# EAGLE design contact control board (EAGLE 6.5.0)
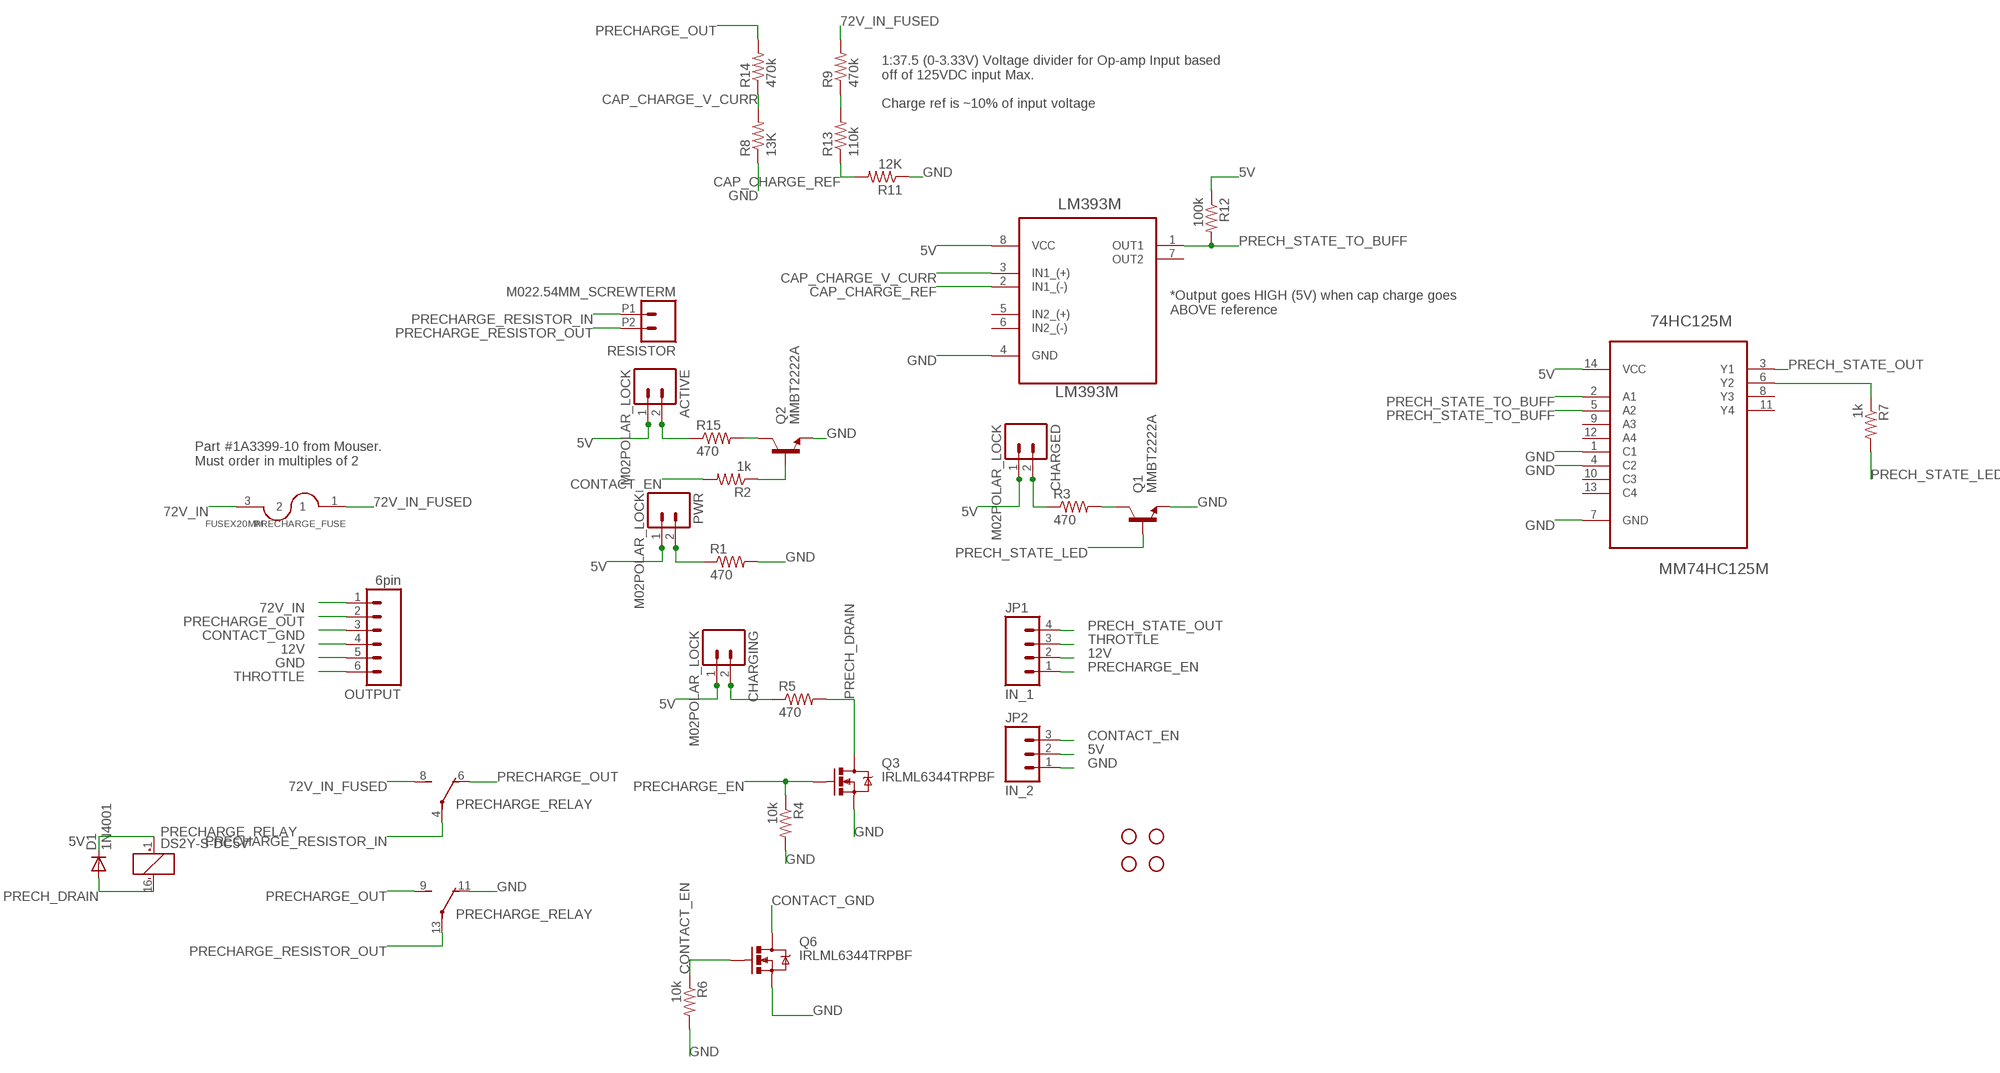
[diagram p0: schematic, sheet 1]

## Parts
74HC125M  MM74HC125M  [SOIC127P600X175-14N]
ACTIVE  M02POLAR_LOCK  [MOLEX-1X2_LOCK]
CHARGED  M02POLAR_LOCK  [MOLEX-1X2_LOCK]
CHARGING  M02POLAR_LOCK  [MOLEX-1X2_LOCK]
D1  1N4001  DIODEPTH  [DIODE-1N4001]
JP1  IN_1  M04POLAR_LOCK  [MOLEX-1X4_LOCK]
JP2  IN_2  M03POLAR_LOCK  [MOLEX-1X3_LOCK]
LM393M  LM393M  [SOIC127P600X180-8N]
OUTPUT  6pin  M063.5MM-6  [SCREWTERMINAL-3.5MM-6]
PRECHARGE_FUSE  FUSEX20MM  [FUSE_5MM]
PRECHARGE_RELAY  DS2Y-S-DC5V  [DS2Y]
PWR  M02POLAR_LOCK  [MOLEX-1X2_LOCK]
Q1  MMBT2222A  TRANSISTOR_NPNMMBT2222A  [SOT23]
Q2  MMBT2222A  TRANSISTOR_NPNMMBT2222A  [SOT23]
Q3  IRLML6344TRPBF  MOSFET-NCHANNELBSS123LT1G  [SOT23]
Q6  IRLML6344TRPBF  MOSFET-NCHANNELBSS123LT1G  [SOT23]
R1  470  RESISTOR0805-RES  [0805]
R2  1k  RESISTOR0603-RES  [0603-RES]
R3  470  RESISTOR0805-RES  [0805]
R4  10k  RESISTOR0603-RES  [0603-RES]
R5  470  RESISTOR0805-RES  [0805]
R6  10k  RESISTOR0603-RES  [0603-RES]
R7  1k  RESISTOR0603-RES  [0603-RES]
R8  13K  RESISTOR0805-RES  [0805]
R9  470k  RESISTOR0805-RES  [0805]
R11  12K  RESISTOR0805-RES  [0805]
R12  100k  RESISTOR0603-RES  [0603-RES]
R13  110k  RESISTOR0805-RES  [0805]
R14  470k  RESISTOR0805-RES  [0805]
R15  470  RESISTOR0805-RES  [0805]
RESISTOR  M022.54MM_SCREWTERM  [1X02_2.54_SCREWTERM]
STANDOFF1  STAND-OFF  [STAND-OFF]
STANDOFF2  STAND-OFF  [STAND-OFF]
STANDOFF3  STAND-OFF  [STAND-OFF]
STANDOFF4  STAND-OFF  [STAND-OFF]

## Nets
5V: 74HC125M.14(VCC) ACTIVE.1 CHARGED.1 CHARGING.1 D1.C JP2.2 LM393M.8(VCC) PRECHARGE_RELAY.1(1:+) PWR.1 R12.1
12V: JP1.2 OUTPUT.4
72V_IN: OUTPUT.1 PRECHARGE_FUSE.3
72V_IN_FUSED: PRECHARGE_FUSE.1 PRECHARGE_RELAY.8(2:S) R9.2
CAP_CHARGE_REF: LM393M.2(IN1_(-)) R11.2 R13.1
CAP_CHARGE_V_CURR: LM393M.3(IN1_(+)) R8.2 R14.1
CONTACT_EN: JP2.3 Q6.1(G) R2.2 R6.1
CONTACT_GND: OUTPUT.3 Q6.3(D)
GND: 74HC125M.1(C1) 74HC125M.4(C2) 74HC125M.7(GND) JP2.1 LM393M.4(GND) OUTPUT.5 PRECHARGE_RELAY.11(3:O) Q1.2(E) Q2.2(E) Q3.2(S) Q6.2(S) R1.2 R4.2 R6.2 R8.1 R11.1
N$1: Q2.3(C) R15.2
N$2: Q2.1(B) R2.1
N$3: R9.1 R13.2
N$4: CHARGED.2 R3.1
N$5: Q1.3(C) R3.2
N$6: 74HC125M.6(Y2) R7.1
N$7: CHARGING.2 R5.1
N$9: ACTIVE.2 R15.1
N$12: PWR.2 R1.1
PRECH_DRAIN: D1.A PRECHARGE_RELAY.16(1:-) Q3.3(D) R5.2
PRECH_STATE_LED: Q1.1(B) R7.2
PRECH_STATE_OUT: 74HC125M.3(Y1) JP1.4
PRECH_STATE_TO_BUFF: 74HC125M.2(A1) 74HC125M.5(A2) LM393M.1(OUT1) R12.2
PRECHARGE_EN: JP1.1 Q3.1(G) R4.1
PRECHARGE_OUT: OUTPUT.2 PRECHARGE_RELAY.6(2:O) PRECHARGE_RELAY.9(3:S) R14.2
PRECHARGE_RESISTOR_IN: PRECHARGE_RELAY.4(2:P) RESISTOR.P1
PRECHARGE_RESISTOR_OUT: PRECHARGE_RELAY.13(3:P) RESISTOR.P2
THROTTLE: JP1.3 OUTPUT.6
Unconnected: 74HC125M.8(Y3) 74HC125M.9(A3) 74HC125M.10(C3) 74HC125M.11(Y4) 74HC125M.12(A4) 74HC125M.13(C4) LM393M.5(IN2_(+)) LM393M.6(IN2_(-)) LM393M.7(OUT2)

## Notes on the sheet
- 1:37.5 (0-3.33V) Voltage divider for Op-amp Input based
  off of 125VDC input Max.
  
  Charge ref is ~10% of input voltage
- *Output goes HIGH (5V) when cap charge goes
  ABOVE reference
- Part #1A3399-10 from Mouser. 
  Must order in multiples of 2

## Library data of the parts
74HC125M = Fairchild_By_element14_Batch_1:MM74HC125M: 3-STATE Quad Buffers; MPN: MM74HC125M; OC_FARNELL: 1013962; OC_NEWARK: 78K6059; PACKAGE: SOIC-14; SUPPLIER: Fairchild
ACTIVE CHARGED CHARGING PWR RESISTOR = SparkFun-Connectors:M02: Standard 2-pin 0.1" header. Use with - straight break away headers ( PRT-00116) - right angle break away headers (PRT-00553) - swiss pins (PRT-00743) - machine pins (PRT-00117) - female headers (PRT-00115) Molex polarized connector foot print use with: PRT-08233 with associated crimp pins and housings. 2.54_SCREWTERM for use with PRT-10571. 3.5mm Screw Terminal footprints for PRT-08084 5mm Screw Terminal footprints for use with PRT-08433
D1 = SparkFun-DiscreteSemi:DIODE: Diode These are standard reverse protection diodes and small signal diodes. SMA package can handle up to about 1A. SOD-323 can handle about 200mA. What the SOD-323 package when ordering, there are some mfgs out there that are 5-pin packages.
JP1 = SparkFun-Connectors:M04: Header 4 Standard 4-pin 0.1" header. Use with straight break away headers (SKU : PRT-00116), right angle break away headers (PRT-00553), swiss pins (PRT-00743), machine pins (PRT-00117), and female headers (PRT-00115). Molex polarized connector foot print use with SKU : PRT-08231 with associated crimp pins and housings. 1MM SMD Version SKU: PRT-10208
JP2 = SparkFun-Connectors:M03: Header 3 Standard 3-pin 0.1" header. Use with straight break away headers (SKU : PRT-00116), right angle break away headers (PRT-00553), swiss pins (PRT-00743), machine pins (PRT-00117), and female headers (PRT-00115). Molex polarized connector foot print use with SKU : PRT-08232 with associated crimp pins and housings.
LM393M = Fairchild_By_element14_Batch_1:LM393M: Dual Differential Comparator; MPN: LM393M; OC_FARNELL: 9487590; OC_NEWARK: 78K6008; PACKAGE: SO-8; SUPPLIER: FAIRCHILD SEMICONDUCTOR
OUTPUT = SparkFun-Connectors:M06: Header 6 Standard 6-pin 0.1" header. Use with straight break away headers (SKU : PRT-00116), right angle break away headers (PRT-00553), swiss pins (PRT-00743), machine pins (PRT-00117), and female headers (PRT-00115). Molex polarized connector foot print use with SKU : PRT-08094 with associated crimp pins and housings. NOTES ON THE VARIANTS LOCK and LOCK_LONGPADS... This footprint was designed to help hold the alignment of a through-hole component (i.e. 6-pin header) while soldering it into place. You may notice that each hole has been shifted either up or down by 0.005 of an inch from it's more standard position (which is a perfectly straight line). This slight alteration caused the pins (the squares in the middle) to touch the edges of the holes. Because they are alternating, it causes a "brace" to hold the component in place. 0.005 has proven to be the perfect amount of "off-center" position when using our standard breakaway headers. Although looks a little odd when you look at the bare footprint, once you have a header in there, the alteration is very hard to notice. Also,if you push a header all the way into place, it is covered up entirely on the bottom side. This idea of altering the position of holes to aid alignment will be further integrated into the Sparkfun Library for other footprints. It can help hold any component with 3 or more connection pins.
PRECHARGE_FUSE = SparkFun-Passives:FUSE
PRECHARGE_RELAY = relay:DS2Y-S-DC*: MINIATURE RELAY NAiS Source: http://www.mew-europe.com/.. en_ds_61005_0023.pdf; MPN: DS2Y-S-DC5V; OC_FARNELL: unknown; OC_NEWARK: 13P3268
Q1 Q2 = SparkFun-DiscreteSemi:TRANSISTOR_NPN: Generic NPN BJT MMBT2222A - TRANS-08049 (SOT-23, 1A 40V) MPSA42 - TRANS-09116 (SOT-23, 500mA 300V) MMBT5088LT1G - TRANS-11160 (SOT-23, 50 mA 30V); PROD_ID: TRANS-08049
Q3 Q6 = SparkFun-DiscreteSemi:MOSFET-NCHANNEL: Common NMOSFET Parts MFG P/N Store ID Prod ID FDD8780 TRANS-09984 SI7820DN TRANS-11055 FDS6630A IC-08089 2N7002PW TRANS-11151 FQP30N06L COM-10213 TRANS-10060 BSS123LT1G TRANS-08345 BSS138 TRANS-00830 BS170 2N7000; PROD_ID: TRANS-08345
R1-R9 R11-R15 = SparkFun-Resistors:RESISTOR: Resistor Basic schematic elements and footprints for 0603, 1206, and PTH resistors.
STANDOFF1-STANDOFF4 = SparkFun-Electromechanical:STAND-OFF: #4 Stand Off This is the mechanical footprint for a #4 phillips button head screw. Use the keepout ring to avoid running the screw head into surrounding components. SKU : PRT-00447

## Board
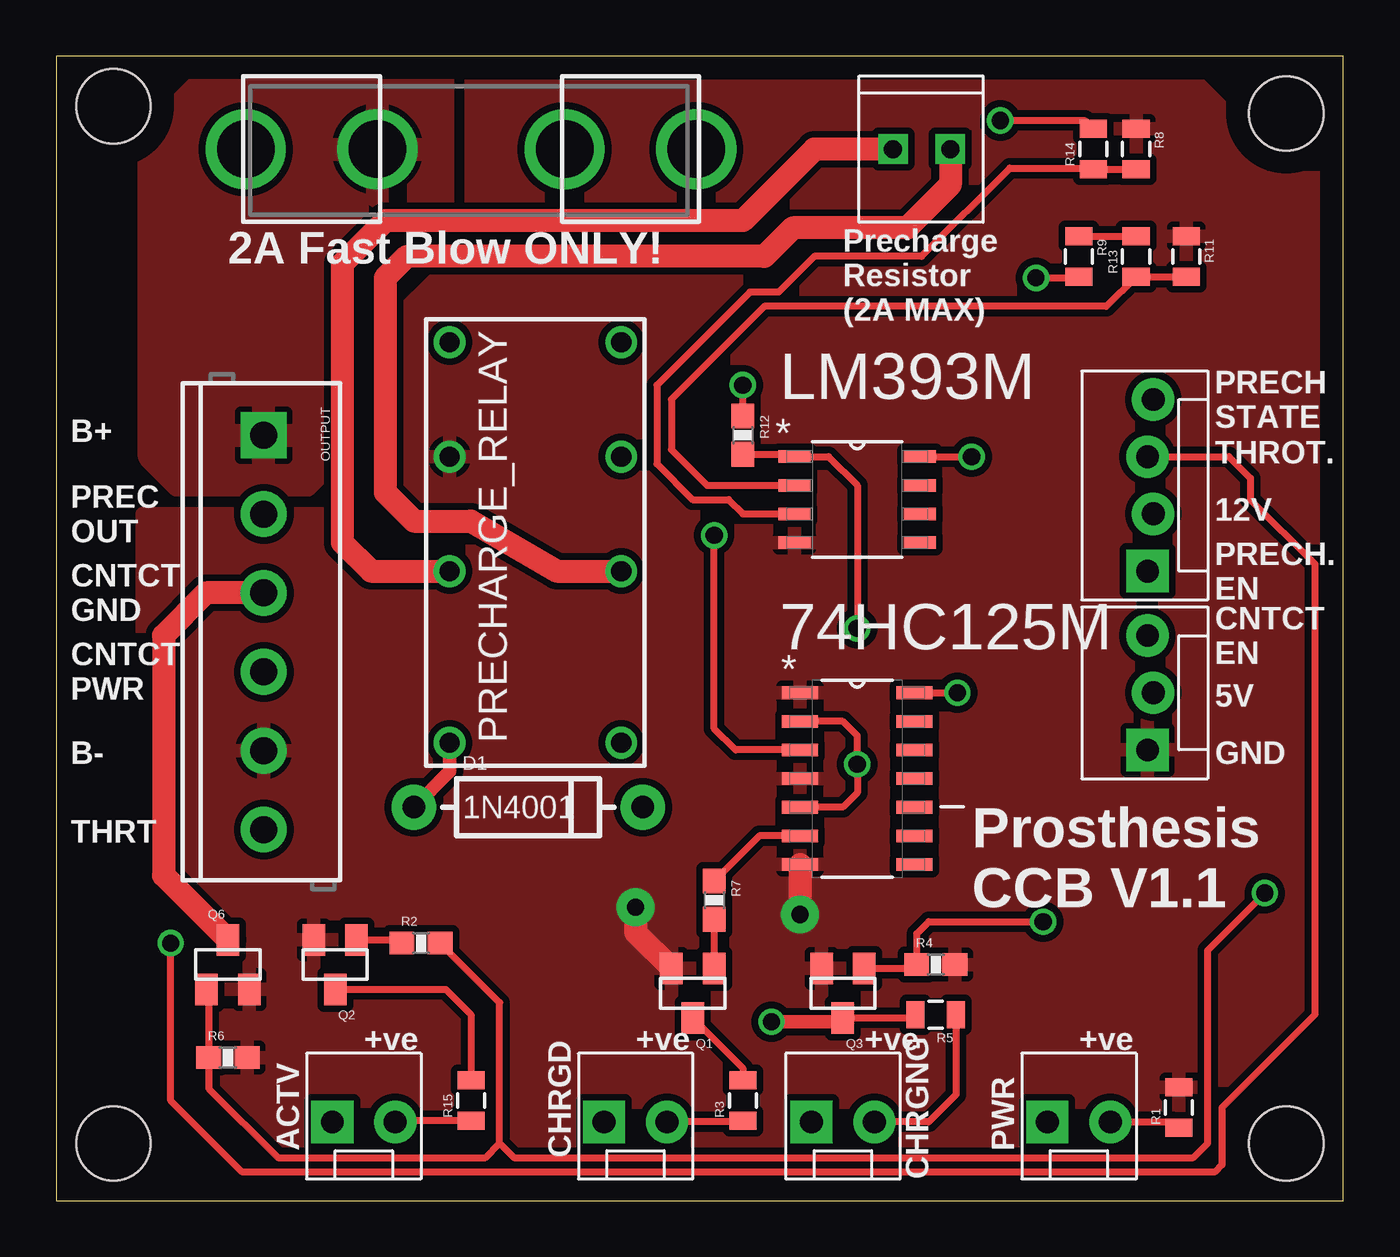
[diagram p1: board, top side]
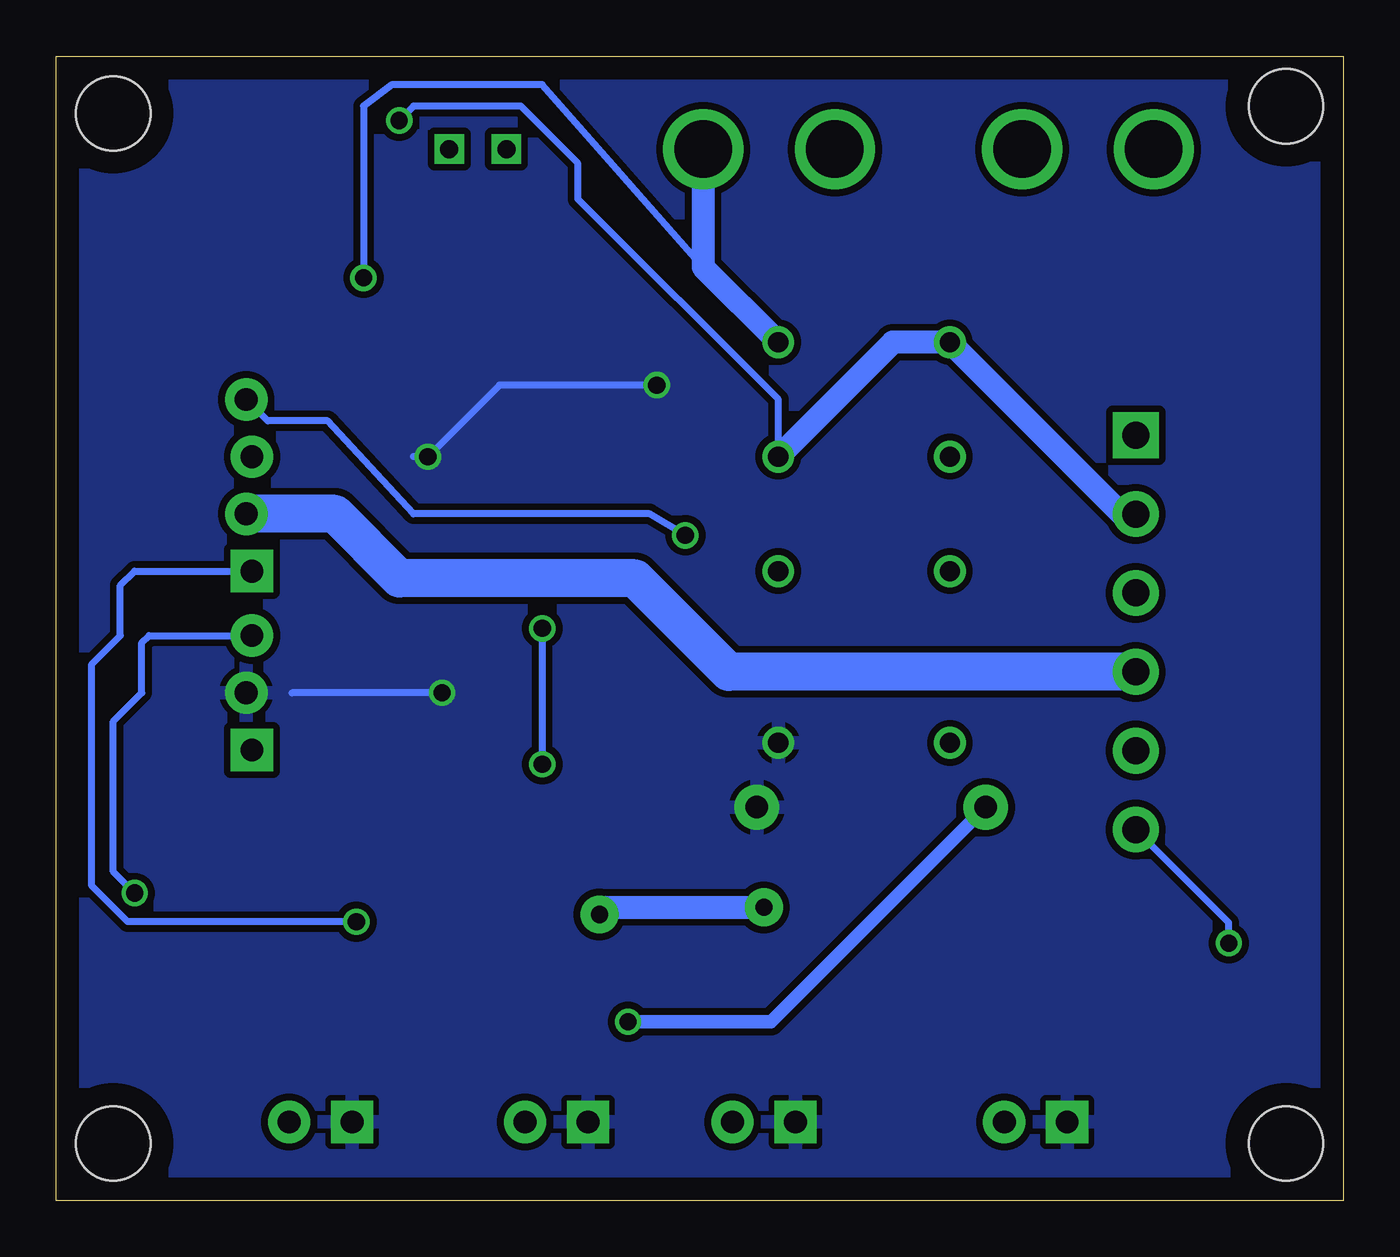
[diagram p2: board, bottom side, seen from below]

Size 57.14 x 50.79 mm. Coordinates in mm from the lower left corner, seen from the top.
Outline: 0,0 57.14,0 57.14,50.79 0,50.79 0,0
Copper layers (1*16): Top 0.035mm / dielectric 1.5mm / Bottom 0.035mm
Design rules "default": minimum track width 10mil, minimum drill 24mil, track to track 8mil, track to pad 8mil, pad to pad 8mil, via to via 8mil, smd to smd 8mil, copper to edge 40mil, drill to drill 8mil, minimum pad ring 10mil, minimum via ring 8mil, stop-mask expansion 4mil, vias tented up to drill 0mil, thermal gap 10mil

### Footprints (pad centres in the part's own frame; a part is rotated, then mirrored left to right if it is on the bottom)
SOIC127P600X175-14N = smd 1.6 x 0.559: 1 -2.54,3.81; 2 -2.54,2.54; 3 -2.54,1.27; 4 -2.54,0; 5 -2.54,-1.27; 6 -2.54,-2.54; 7 -2.54,-3.81; 8 2.54,-3.81; 9 2.54,-2.54; 10 2.54,-1.27; 11 2.54,0; 12 2.54,1.27; 13 2.54,2.54; 14 2.54,3.81
MOLEX-1X2_LOCK = drill 1.016 pad 1.88 square: 1 -0.127,0 | drill 1.016 pad 1.88: 2 2.667,0
DIODE-1N4001 = drill 1 pad 1.981: A -5.08,0; C 5.08,0
MOLEX-1X4_LOCK = drill 1.016 pad 1.88 square: 1 0,0.127 | drill 1.016 pad 1.88: 2 2.54,-0.127; 3 5.08,0.127; 4 7.62,-0.127
MOLEX-1X3_LOCK = drill 1.016 pad 1.88 square: 1 0,0.127 | drill 1.016 pad 1.88: 2 2.54,-0.127; 3 5.08,0.127
SOIC127P600X180-8N = smd 1.422 x 0.559: 1 -2.794,1.905; 2 -2.794,0.635; 3 -2.794,-0.635; 4 -2.794,-1.905; 5 2.794,-1.905; 6 2.794,-0.635; 7 2.794,0.635; 8 2.794,1.905
SCREWTERMINAL-3.5MM-6 = drill 1.2 pad 2.032 square: 1 0,0 | drill 1.2 pad 2.032: 2 3.5,0; 3 7,0; 4 10.5,0; 5 14,0; 6 17.5,0
FUSE_5MM = drill 2.54 pad 3.556: 1 0,-10; 2 0,-4.158; 3 0,4.158; 4 0,10
DS2Y = drill 0.9: 1 -8.89,-3.81; 4 -1.27,-3.81; 6 3.81,-3.81; 8 8.89,-3.81; 9 8.89,3.81; 11 3.81,3.81; 13 -1.27,3.81; 16 -8.89,3.81
SOT23 = smd 1 x 1.4: 1 -0.95,-1.1; 2 0.95,-1.1; 3 0,1.1
0805 = smd 0.8 x 1.2: 1 -0.9,0; 2 0.9,0
0603-RES = smd 1.1 x 1: 1 -0.85,0; 2 0.85,0
1X02_2.54_SCREWTERM = drill 0.8 square: P1 2.54,0; P2 0,0
STAND-OFF = hole 3.302: 0,0

### Placement (x,y rotation side)
74HC125M  35.56,18.73 0 top
ACTIVE  12.38,3.49 0 top
CHARGED  24.45,3.49 0 top
CHARGING  33.66,3.49 0 top
D1  20.95,17.46 0 top
JP1  48.58,27.94 90 top
JP2  48.58,20 90 top
LM393M  35.56,31.11 0 top
OUTPUT  9.21,33.97 270 top
PRECHARGE_FUSE  18.41,46.67 90 top
PRECHARGE_RELAY  21.27,29.21 90 top
PWR  44.13,3.49 0 top
Q1  28.26,9.21 180 top
Q2  12.38,10.48 180 top
Q3  34.92,9.21 180 top
Q6  7.62,10.48 0 top
R1  49.85,4.13 90 top
R2  16.19,11.43 0 top
R3  30.48,4.45 90 top
R4  39.05,10.48 0 top
R5  39.05,8.26 180 top
R6  7.62,6.35 0 top
R7  29.21,13.34 270 top
R8  47.94,46.67 270 top
R9  45.4,41.91 270 top
R11  50.16,41.91 270 top
R12  30.48,33.97 270 top
R13  47.94,41.91 90 top
R14  46.04,46.67 90 top
R15  18.41,4.45 90 top
RESISTOR  37.15,46.67 0 top
STANDOFF1  2.54,2.54 0 top
STANDOFF2  2.54,48.58 0 top
STANDOFF3  54.61,48.26 0 top
STANDOFF4  54.61,2.54 0 top

### Tracks (layer width: path | path; a pad name or v marks a point on that pad's centre or on a via)
5V  (via drill 0.76)
  Top 0.305: LM393M.8 v40.64,33.02 | R12.1 v30.48,36.2 | 74HC125M.14 v40.01,22.54
  Bottom 0.305: 41.27,33.02 v40.64,33.02 37.47,36.2 v30.48,36.2 | v40.01,22.54 46.67,22.54
  pour Bottom (isolate 0.305): 0.95,50.16 0.95,0.64 56.52,0.95 56.52,50.16
12V
  Bottom 1.676: OUTPUT.4 27.28,23.47 31.43,27.62 41.91,27.62 44.77,30.48 JP1.2
72V_IN
  pour Top (isolate 0.305): 17.14,50.16 17.14,43.18 12.38,38.42 12.38,33.02 11.11,31.75 5.4,31.75 4.13,33.02 4.13,47.31 6.99,50.16
72V_IN_FUSED  (via drill 0.76)
  Top 0.305: v43.5,40.96 45.35,40.96 R9.2
  Bottom 0.305: 28.41,41.43 35.56,49.53 42.23,49.53 43.5,48.58 v43.5,40.96
  Bottom 1.016: PRECHARGE_FUSE.1 28.41,41.43 PRECHARGE_RELAY.8
CAP_CHARGE_REF
  Top 0.305: LM393M.2 28.89,31.75 27.3,33.34 27.3,35.56 31.43,39.69 46.62,39.69 R13.1 R11.2
CAP_CHARGE_V_CURR
  Top 0.305: LM393M.3 30.48,30.48 29.84,31.11 28.26,31.11 26.67,32.7 26.67,36.2 30.8,40.32 32.07,40.32 33.66,41.91 38.42,41.91 42.33,45.82 45.99,45.82 R14.1 R8.2
CONTACT_EN  (via drill 0.76)
  Top 0.305: Q6.1 6.77,9.28 R6.1 6.77,4.98 9.84,1.91 19.05,1.91 19.68,2.54 | 19.68,2.54 20.32,1.91 50.48,1.91 51.12,2.54 51.12,11.11 v53.66,13.65 | 19.68,2.54 19.68,8.79 R2.2
  Bottom 0.305: v53.66,13.65 54.61,14.61 54.61,21.27 53.34,22.54 53.34,24.77 53.02,25.08 JP2.3
CONTACT_GND
  Top 1.016: OUTPUT.3 6.65,26.97 4.76,25.08 4.76,14.44 Q6.3
GND  (via drill 0.76 pad 1.68)
  Top 1.016: 74HC125M.7 v33.02,12.7 | v25.72,13.02 25.72,11.9 Q1.2
  Bottom 1.016: v33.02,12.7 32.7,13.02 v25.72,13.02
  pour Top (isolate 0.305): 50.48,49.85 52.07,48.26 52.07,46.99 53.66,45.4 56.52,45.4 56.52,6.35 55.24,5.08 53.66,5.08 52.07,3.49 52.07,0.95 10.48,0.95 3.81,6.35 3.81,30.48 11.75,30.48 13.65,32.38 13.65,37.78 18.41,42.55 18.41,49.85
N$1
  Top 0.305: Q2.3 17.29,9.38 18.41,8.26 R15.2
N$2
  Top 0.305: Q2.1 15.2,11.58 R2.1
N$3
  Top 0.305: R9.1 R13.2
N$4
  Top 0.305: CHARGED.2 30.43,3.49 R3.1
N$5
  Top 0.305: Q1.3 30.48,5.88 R3.2
N$6
  Top 0.305: 74HC125M.6 31.22,16.19 R7.1
N$7
  Top 0.305: CHARGING.2 38.73,3.49 39.95,4.71 R5.1
N$9
  Top 0.254: ACTIVE.2 15.05,3.37 15.14,3.28
  Top 0.305: R15.1 15.1,3.54 ACTIVE.2
N$12
  Top 0.305: PWR.2 46.67,3.49 46.35,3.17 46.48,3.17 PWR.2 | PWR.2 49.58,3.49 R1.1
PRECH_DRAIN  (via drill 0.76)
  Top 0.305: Q3.3 38.01,8.11 R5.2
  Top 0.61: PRECHARGE_RELAY.16 17.46,19.05 D1.A | Q3.3 34.76,7.94 v31.75,7.94
  Bottom 0.61: v31.75,7.94 25.4,7.94 D1.A
PRECH_STATE_LED
  Top 0.305: R7.2 Q1.1
PRECH_STATE_OUT  (via drill 0.76)
  Top 0.305: 74HC125M.3 30.16,20 29.21,20.95 v29.21,29.53
  Bottom 0.305: v29.21,29.53 30.8,30.48 41.27,30.48 45.09,34.61 47.75,34.61 JP1.4
PRECH_STATE_TO_BUFF  (via drill 0.76)
  Top 0.305: R12.2 32.66,33.12 LM393M.1 34.29,33.02 35.56,31.75 v35.56,25.4 | 74HC125M.5 34.92,17.46 35.56,18.1 v35.56,19.37 35.56,20.64 34.92,21.27 74HC125M.2
  Bottom 0.305: v35.56,25.4 v35.56,19.37
PRECHARGE_EN  (via drill 0.76)
  Top 0.305: Q3.1 38.03,10.31 R4.1 38.2,11.85 38.73,12.38 v43.81,12.38
  Bottom 0.305: v43.81,12.38 53.98,12.38 55.56,13.97 55.56,23.81 54.29,25.08 54.29,27.3 53.66,27.94 JP1.1
PRECHARGE_OUT  (via drill 0.76)
  Top 0.305: v41.91,47.94 45.67,47.94 R14.2
  Bottom 0.305: PRECHARGE_RELAY.6 25.08,35.56 33.97,44.45 33.97,46.04 36.51,48.58 41.27,48.58 v41.91,47.94
  Bottom 1.016: OUTPUT.2 9.84,30.47 PRECHARGE_RELAY.9 20,38.1 PRECHARGE_RELAY.6
PRECHARGE_RESISTOR_IN
  Top 1.016: RESISTOR.P1 39.69,45.09 37.78,43.18 32.7,43.18 31.43,41.91 15.56,41.91 14.61,40.96 14.61,31.43 15.88,30.16 18.41,30.16 22.23,27.94 PRECHARGE_RELAY.4
PRECHARGE_RESISTOR_OUT
  Top 1.016: RESISTOR.P2 33.66,46.67 30.48,43.5 14.61,43.5 12.7,41.59 12.7,29.21 13.97,27.94 PRECHARGE_RELAY.13
THROTTLE  (via drill 0.76)
  Top 0.305: v5.08,11.43 5.08,4.45 8.26,1.27 51.44,1.27 51.75,1.59 51.75,4.13 55.88,8.26 55.88,28.26 53.02,31.11 53.02,32.07 52.07,33.02 JP1.3
  Bottom 0.305: v5.08,11.43 5.08,12.35 OUTPUT.6

### Text on the board
tNames: 2A Fast Blow ONLY! | Precharge / Resistor / (2A MAX) | B+ | PRECH / STATE | THROT. | 12V | PREC / OUT | PRECH. / EN | CNTCT / GND | CNTCT / EN | CNTCT / PWR | 5V | B- | GND | THRT | Prosthesis / CCB V1.1 | +ve | +ve | +ve | +ve | ACTV | CHRGD | PWR | CHRGNG